# EAGLE schematic DSP (EAGLE 8.6.0)
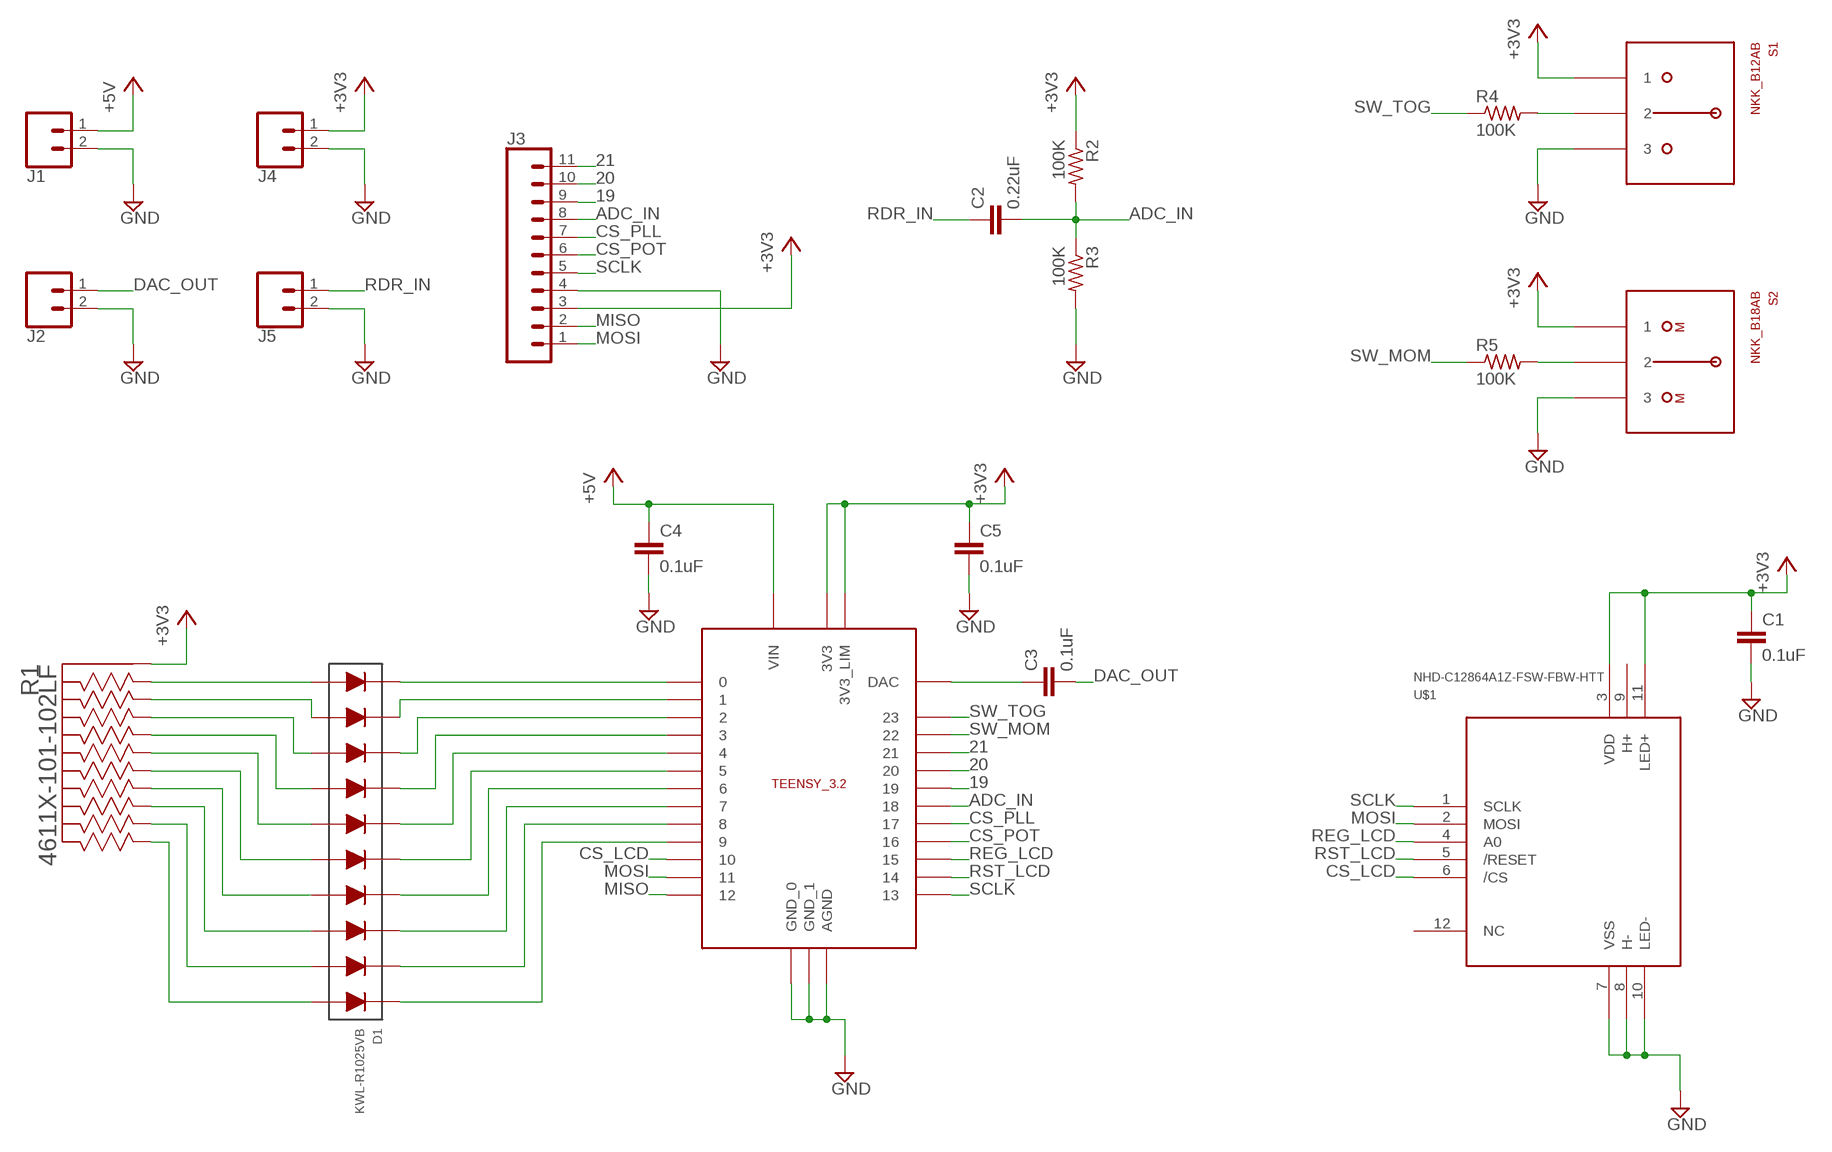
[diagram p0: schematic, sheet 1]

## Parts
C1  0.1uF  C0603  [0603]
C2  0.22uF  C0603  [0603]
C3  0.1uF  C0603  [0603]
C4  0.1uF  C0603  [0603]
C5  0.1uF  C0603  [0603]
D1  KWL-R1025VB  [KWL-R1025VB]
J1  CONN_02  [1X02]
J2  CONN_02  [1X02]
J3  CONN_11  [1X11]
J4  CONN_02  [1X02]
J5  CONN_02  [1X02]
R1  4611X-101-102LF  [BO_4611X]
R2  100K  R0603  [0603]
R3  100K  R0603  [0603]
R4  100K  R0603  [0603]
R5  100K  R0603  [0603]
S1  NKK_B12AB  [NKK_SPDT_BRKT]
S2  NKK_B18AB  [NKK_SPDT_BRKT]
TEENSY_3.2  TEENSY_3.2_SOCKET  [TEENSY_3.2_SOCKET]
U$1  NHD-C12864A1Z-FSW-FBW-HTT  [NHD-C12864A1Z-FSW-FBW-HTT]

## Nets
19: J3.9 TEENSY_3.2.19
20: J3.10 TEENSY_3.2.20
21: J3.11 TEENSY_3.2.21
+3V3: C1.1 C5.1 J3.3 J4.1 R1.1 R2.1 S1.3 S2.3 TEENSY_3.2.3V3 TEENSY_3.2.3V3_LIM U$1.3(VDD) U$1.11(LED+)
+5V: C4.1 J1.1 TEENSY_3.2.VIN
ADC_IN: C2.2 J3.8 R2.2 R3.1 TEENSY_3.2.18
CS_LCD: TEENSY_3.2.10 U$1.6(/CS)
CS_PLL: J3.7 TEENSY_3.2.17
CS_POT: J3.6 TEENSY_3.2.16
DAC_OUT: C3.2 J2.1
GND: C1.2 C4.2 C5.2 J1.2 J2.2 J3.4 J4.2 J5.2 R3.2 S1.5 S2.5 TEENSY_3.2.AGND TEENSY_3.2.GND_0 TEENSY_3.2.GND_1 U$1.7(VSS) U$1.8(H-) U$1.10(LED-)
MISO: J3.2 TEENSY_3.2.12
MOSI: J3.1 TEENSY_3.2.11 U$1.2(MOSI)
N$1: C3.1 TEENSY_3.2.DAC
N$2: R5.2 S2.4
N$3: D1.1+ R1.2
N$4: D1.2+ R1.3
N$5: D1.3+ R1.4
N$6: D1.4+ R1.5
N$7: D1.5+ R1.6
N$8: D1.6+ R1.7
N$9: D1.7+ R1.8
N$10: D1.8+ R1.9
N$11: D1.9+ R1.10
N$12: D1.10+ R1.11
N$13: D1.1- TEENSY_3.2.0
N$14: D1.2- TEENSY_3.2.1
N$15: D1.3- TEENSY_3.2.2
N$16: D1.4- TEENSY_3.2.3
N$17: D1.5- TEENSY_3.2.4
N$18: D1.6- TEENSY_3.2.5
N$19: D1.7- TEENSY_3.2.6
N$20: D1.8- TEENSY_3.2.7
N$21: D1.9- TEENSY_3.2.8
N$22: D1.10- TEENSY_3.2.9
N$23: R4.2 S1.4
RDR_IN: C2.1 J5.1
REG_LCD: TEENSY_3.2.15 U$1.4(A0)
RST_LCD: TEENSY_3.2.14 U$1.5(/RESET)
SCLK: J3.5 TEENSY_3.2.13 U$1.1(SCLK)
SW_MOM: R5.1 TEENSY_3.2.22
SW_TOG: R4.1 TEENSY_3.2.23
Unconnected: U$1.9(H+) U$1.12(NC)

## Library data of the parts
C1-C5 = kiss_z:C0603
D1 = kiss_z:KWL-R1025VB
J1 J2 J4 J5 = SparkFun-Connectors:CONN_02: Multi connection point. Often used as Generic Header-pin footprint for 0.1 inch spaced/style header connections On any of the 0.1 inch spaced packages, you can populate with these: Break Away Headers - Straight <https://www.sparkfun.com/products/116> (PRT-00116) Break Away Male Headers - Right Angle <https://www.sparkfun.com/products/553> (PRT-00553) Female Headers <https://www.sparkfun.com/products/115> (PRT-00115) Break Away Headers - Machine Pin <https://www.sparkfun.com/products/117> (PRT-00117) Break Away Female Headers - Swiss Machine Pin <https://www.sparkfun.com/products/743> (PRT-00743) For SCREWTERMINALS and SPRING TERMINALS visit here: Screw Terimnals on SparkFun.com <https://www.sparkfun.com/search/results?term=Screw+Terminals> (5mm/3.5mm/2.54mm spacing) This device is also useful as a general connection point to wire up your design to another part of your project. Our various solder wires solder well into these plated through hole pads. Hook-Up Wire - Assortment (Stranded, 22 AWG) <https://www.sparkfun.com/products/11375> (PRT-11375) Hook-Up Wire - Assortment (Solid Core, 22 AWG) <https://www.sparkfun.com/products/11367> (PRT-11367) View the entire wire category on our website here <https://www.sparkfun.com/categories/141> Special notes: Molex polarized connector foot print use with: PRT-08233 with associated crimp pins and housings. 2.54_SCREWTERM for use with PRT-10571. 3.5mm Screw Terminal footprints for PRT-08084 5mm Screw Terminal footprints for use with PRT-08432
J3 = SparkFun-Connectors:CONN_11: Multi connection point. Often used as Generic Header-pin footprint for 0.1 inch spaced/style header connections On any of the 0.1 inch spaced packages, you can populate with these: Break Away Headers - Straight <https://www.sparkfun.com/products/116> (PRT-00116) Break Away Male Headers - Right Angle <https://www.sparkfun.com/products/553> (PRT-00553) Female Headers <https://www.sparkfun.com/products/115> (PRT-00115) Break Away Headers - Machine Pin <https://www.sparkfun.com/products/117> (PRT-00117) Break Away Female Headers - Swiss Machine Pin <https://www.sparkfun.com/products/743> (PRT-00743) For SCREWTERMINALS and SPRING TERMINALS visit here: Screw Terimnals on SparkFun.com <https://www.sparkfun.com/search/results?term=Screw+Terminals> (5mm/3.5mm/2.54mm spacing) This device is also useful as a general connection point to wire up your design to another part of your project. Our various solder wires solder well into these plated through hole pads. Hook-Up Wire - Assortment (Stranded, 22 AWG) <https://www.sparkfun.com/products/11375> (PRT-11375) Hook-Up Wire - Assortment (Solid Core, 22 AWG) <https://www.sparkfun.com/products/11367> (PRT-11367) View the entire wire category on our website here <https://www.sparkfun.com/categories/141>
R1 = kiss_z:4611X-101-102LF; MANUFACTURER_PART_NUMBER: 4611X101102LF; VENDOR: Bourns Electronics
R2-R5 = kiss_z:R0603
S1 = kiss_z:NKK_B12AB
S2 = kiss_z:NKK_B18AB
TEENSY_3.2 = kiss_z:TEENSY_3.2_SOCKET
U$1 = kiss_z:NHD-C12864A1Z-FSW-FBW-HTT